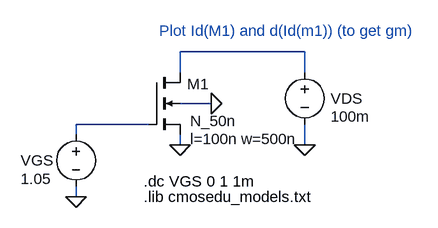
[diagram p0: schematic Fig9_27.asc]
Fig9_27.asc, the LTspice schematic file:
Version 4
SHEET 1 1136 680
WIRE 288 208 288 192
WIRE 288 304 288 288
WIRE 400 192 288 192
WIRE 448 112 448 80
WIRE 448 224 448 208
WIRE 496 160 448 160
WIRE 640 80 448 80
WIRE 640 112 640 80
WIRE 640 224 640 192
FLAG 288 304 0
FLAG 448 224 0
FLAG 640 224 0
FLAG 496 160 0
SYMBOL nmos4 400 112 R0
WINDOW 0 59 18 Left 0
WINDOW 3 64 75 Left 0
WINDOW 123 64 103 Left 0
SYMATTR InstName M1
SYMATTR Value N_50n
SYMATTR Value2 l=100n w=500n
SYMBOL voltage 288 192 R0
WINDOW 0 -85 56 Left 0
WINDOW 3 -85 84 Left 0
WINDOW 123 0 0 Left 0
WINDOW 39 0 0 Left 0
SYMATTR InstName VGS
SYMATTR Value 1.05
SYMBOL voltage 640 96 R0
WINDOW 0 40 56 Left 0
WINDOW 3 40 84 Left 0
WINDOW 123 0 0 Left 0
WINDOW 39 0 0 Left 0
SYMATTR InstName VDS
SYMATTR Value 100m
TEXT 392 280 Left 0 !.dc VGS 0 1 1m
TEXT 392 304 Left 0 !.lib cmosedu_models.txt
TEXT 416 48 Left 0 ;Plot Id(M1) and d(Id(m1)) (to get gm)

The netlist it stands for:
* Fig9_27.asc
M1 N002 N001 0 0 N_50n l=100n w=500n
VGS N001 0 1.05
VDS N002 0 100m
.model NMOS NMOS
.model PMOS PMOS
.lib standard.mos
.dc VGS 0 1 1m
.lib cmosedu_models.txt
* Plot Id(M1) and d(Id(m1)) (to get gm)
.backanno
.end